# Altium schematic sheet main.SchDoc
size A4; ApprovedBy: Krzysztof Belewicz; CheckedBy: Krzysztof Belewicz; Author: Krzysztof Belewicz; CompanyName: Koło Naukowe Systemów Scalonych; DrawnBy: Krzysztof Belewicz; Organization: KNSS; Address1: Koło Naukowe; Address2: Systemów Scalonych; Address3: 00-665 Warszawa; Address4: Nowowiejska 15/19; DocumentNumber: 1; Revision: 1.0; SheetNumber: 1; SheetTotal: 4
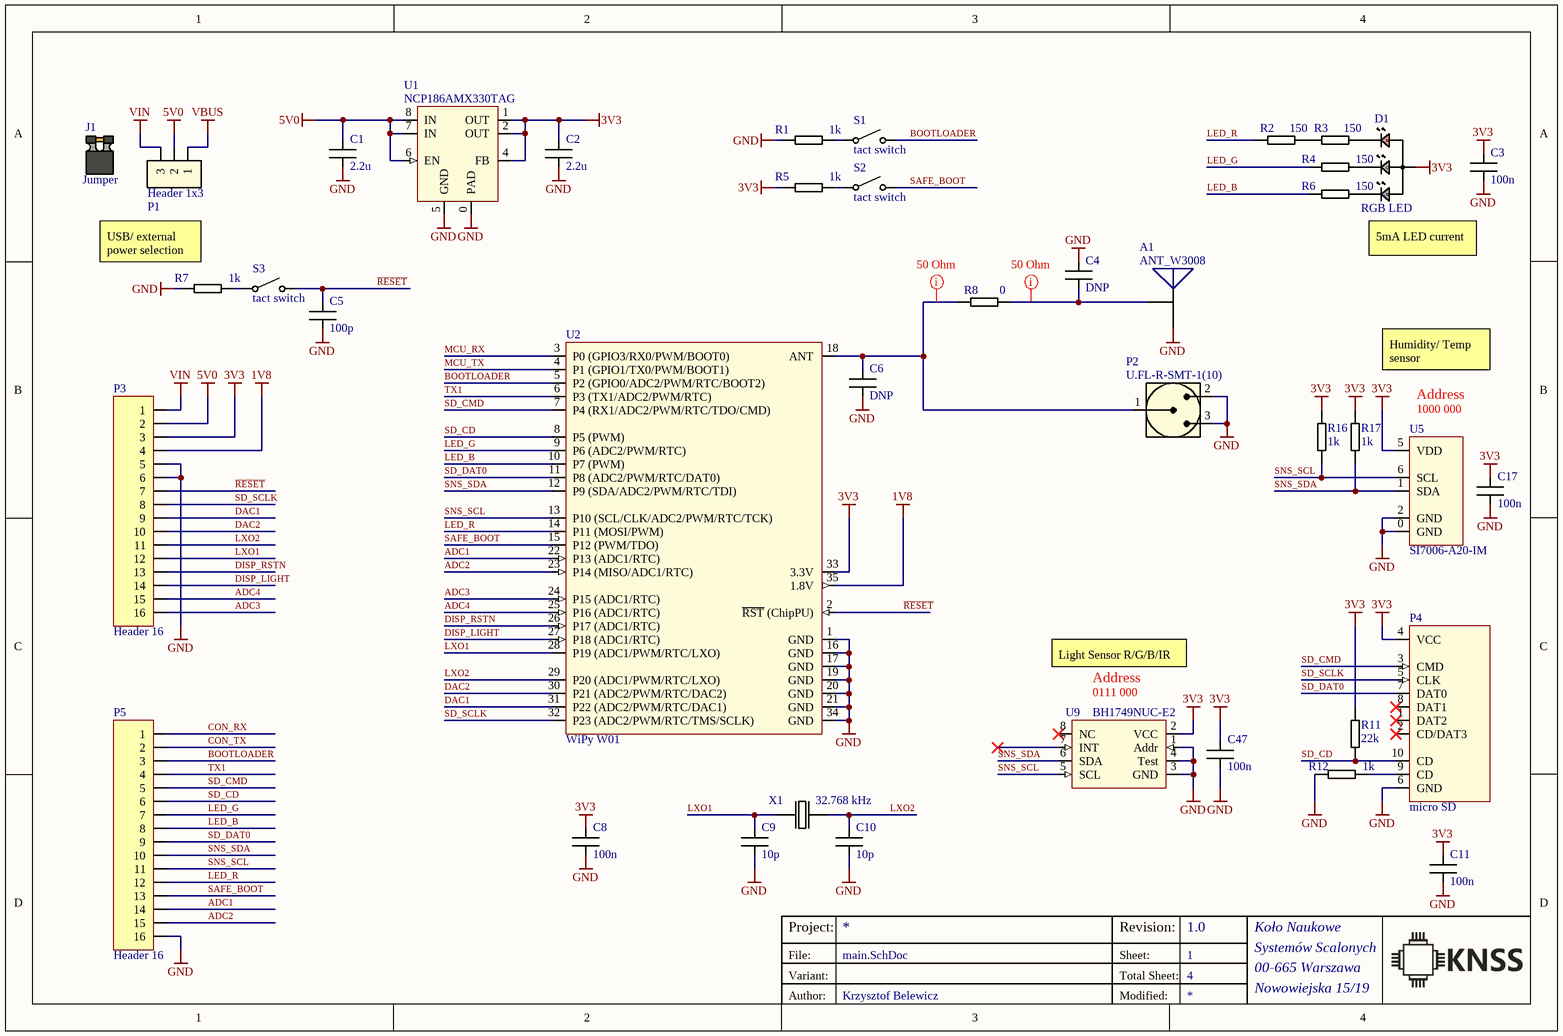
[diagram p0: main.SchDoc]

## Parts
A1  ANT_W3008  [W3008]
C1  value 2.2u  [CAPC1005N]  (hidden comment: Capacitor)
C2  value 2.2u  [CAPC1005N]  (hidden comment: Capacitor)
C3  100n  [CAPC1005N]
C4  value DNP  [CAPC1005N]  (hidden comment: Capacitor)
C5  100p  [CAPC1005N]
C6  value DNP  [CAPC1005N]  (hidden comment: Capacitor)
C8  100n  [CAPC1005N]
C9  10p  [CAPC1005N]
C10  10p  [CAPC1005N]
C11  100n  [CAPC1005N]
C17  100n  [CAPC1005N]
C47  100n  [CAPC1005N]
D1  RGB LED  [PLCC-4]
J1  Jumper  [JUMPER-B]
P1  Header 1x3  [Header 1x3, Male, 2.54mm, Straight, THT]
P2  U.FL-R-SMT-1(10)  [U.FL-R-SMT-1(10)]
P3  Header 16  [HDR1X16]
P4  micro SD  [1140084168]
P5  Header 16  [HDR1X16]
R1  value 1k  [RESC1005N]  (hidden comment: Resistor)
R2  value 150  [RESC1005N]  (hidden comment: Resistor)
R3  value 150  [RESC1005N]  (hidden comment: Resistor)
R4  value 150  [RESC1005N]  (hidden comment: Resistor)
R5  value 1k  [RESC1005N]  (hidden comment: Resistor)
R6  value 150  [RESC1005N]  (hidden comment: Resistor)
R7  value 1k  [RESC1005N]  (hidden comment: Resistor)
R8  value 0  [RESC1005N]  (hidden comment: Resistor)
R11  value 22k  [RESC1005N]  (hidden comment: Resistor)
R12  value 1k  [RESC1005N]  (hidden comment: Resistor)
R16  value 1k  [RESC1005N]  (hidden comment: Resistor)
R17  value 1k  [RESC1005N]  (hidden comment: Resistor)
S1  tact switch  [1301.9319]
S2  tact switch  [1301.9319]
S3  tact switch  [1301.9319]
U1  NCP186AMX330TAG  [XDFN8]
U2  WiPy W01  [WiPy_W01]
U5  SI7006-A20-IM  [DFN6]
U9  BH1749NUC-E2  [WSON-8_Clear]
X1  32.768 kHz  [MC-306]

## Nets
1V8: P3.4 U2.35(1.8V)
3V3: C2.2 C3.2 C8.2 C11.2 C17.2 C47.2 D1.4(A) P3.3 P4.4(VCC) R5.2 R11.2 R16.1 R17.1 U1.1(OUT) U1.2(OUT) U1.4(FB) U2.33(3.3V) U5.5(VDD) U9.2(VCC)
5V0: C1.2 P1.2 P3.2 U1.6(EN) U1.7(IN) U1.8(IN)
GND: A1.2(GND) C1.1 C2.1 C3.1 C4.2 C5.1 C6.1 C8.1 C9.1 C10.1 C11.1 C17.1 C47.1 P2.2 P2.3 P3.5 P3.6 P4.6(GND) P5.16 R1.2 R7.2 R12.2 U1.0(PAD) U1.5(GND) U2.1(GND) U2.16(GND) U2.17(GND) U2.19(GND) U2.20(GND) U2.21(GND) U2.34(GND) U5.0(GND) U5.2(GND) U9.1(Addr) U9.3(GND) U9.4(Test)
VBUS: P1.1
VIN: P1.3 P3.1
ADC1: P5.14 U2.22(P13_(ADC1/RTC))
ADC2: P5.15 U2.23(P14_(MISO/ADC1/RTC))
ADC3: P3.16 U2.24(P15_(ADC1/RTC))
ADC4: P3.15 U2.25(P16_(ADC1/RTC))
BOOTLOADER: P5.3 S1.2 U2.5(P2_(GPIO0/ADC2/PWM/RTC/BOOT2))
CON_RX: P5.1
CON_TX: P5.2
DAC1: P3.9 U2.31(P22_(ADC2/PWM/RTC/DAC1))
DAC2: P3.10 U2.30(P21_(ADC2/PWM/RTC/DAC2))
DISP_LIGHT: P3.14 U2.27(P18_(ADC1/RTC))
DISP_RSTN: P3.13 U2.26(P17_(ADC1/RTC))
LED_B: P5.8 R6.2 U2.10(P7_(PWM))
LED_G: P5.7 R4.2 U2.9(P6_(ADC2/PWM/RTC))
LED_R: P5.12 R2.2 U2.14(P11_(MOSI/PWM))
LXO1: C9.2 P3.12 U2.28(P19_(ADC1/PWM/RTC/LXO)) X1.4
LXO2: C10.2 P3.11 U2.29(P20_(ADC1/PWM/RTC/LXO)) X1.1
MCU_RX: U2.3(P0_(GPIO3/RX0/PWM/BOOT0))
MCU_TX: U2.4(P1_(GPIO1/TX0/PWM/BOOT1))
~{RESET}: C5.2 P3.7 S3.2 U2.2(~{RST}_(ChipPU))
SAFE_BOOT: P5.13 S2.2 U2.15(P12_(PWM/TDO))
SD_CD: P4.10(CD) P5.6 R11.1 U2.8(P5_(PWM))
SD_CMD: P4.3(CMD) P5.5 U2.7(P4_(RX1/ADC2/PWM/RTC/TDO/CMD))
SD_DAT0: P4.7(DAT0) P5.9 U2.11(P8_(ADC2/PWM/RTC/DAT0))
SD_SCLK: P3.8 P4.5(CLK) U2.32(P23_(ADC2/PWM/RTC/TMS/SCLK))
SNS_SCL: P5.11 R16.2 U2.13(P10_(SCL/CLK/ADC2/PWM/RTC/TCK)) U5.6(SCL) U9.5(SCL)
SNS_SDA: P5.10 R17.2 U2.12(P9_(SDA/ADC2/PWM/RTC/TDI)) U5.1(SDA) U9.6(SDA)
TX1: P5.4 U2.6(P3_(TX1/ADC2/PWM/RTC))
NetA1_1: A1.1(SIG) C4.1 R8.1
NetC6_2: C6.2 P2.1 R8.2 U2.18(ANT)
NetD1_1: D1.1(CR) R3.1
NetD1_2: D1.2(CG) R4.1
NetD1_3: D1.3(CB) R6.1
NetP4_9: P4.9(CD) R12.1
NetR1_1: R1.1 S1.1
NetR2_1: R2.1 R3.2
NetR5_1: R5.1 S2.1
NetR7_1: R7.1 S3.1

Not connected (* = marked no-connect by the designer): P4 1(DAT2)* 2(CD/DAT3)* 8(DAT1)*; U9 7(INT)* 8(NC)*

## Layout directives
rule Undefined: NetA1_1, NetC6_2

## Notes on the sheet
- 5mA LED current
- (near R7) USB/ external power selection
- Humidity/ Temp
  sensor
  Addr:
- (near U5) 1000 000
- Address
- Light Sensor R/G/B/IR
- (near U9) 0111 000
- (near U9) Address
- Project:
- Variant:
- File:
- Sheet:
- Revision:
- Total Sheet:
- Author:
- Modified:
- (in symbol ASMB-MTB1-0A3A2) R; G; B

## Library data of the parts
A1 = ANT_W3008: Bluetooth / WLAN / WiFi  Ceramic Chip Antenna W x L x H (3.2 x 1.6 x 1.1 mm); Manufacturer 1: PulseLarsen; Supplier Part Number 1: 673-W3008; Manufacturer Part Number 1: W3008; Manufacturer Part Number 2: W3008; Manufacturer 2: PulseLarsen; Supplier 1: Mouser; Supplier 2: Farnell; Supplier Part Number 2: 2897223
C1 C2 = Capacitor: 0402 SMD Capacitor; Manufacturer 1: MURATA; Manufacturer Part Number 1: GRM155R60J225ME95D; Tolerance: 10%; MaxVoltage: 6.3V; Supplier 1: Farnell; Supplier Part Number 1: 2362091; Manufacturer Part Number 2: GRT155C80J225KE01D; Manufacturer 2: MURATA; Supplier Part Number 2: 2672104; Supplier 2: Farnell
C3 C8 C11 C17 C47 = Capacitor: 0402 SMD Capacitor; Manufacturer Part Number 1: CL05B104KO5NNNC; Manufacturer 1: Samsung; Tolerance: 10%; MaxVoltage: 16V; Supplier 1: TME; Supplier 2: Farnell; Value: 100n; Supplier Part Number 1: CL05B104KO5NNNC; Manufacturer 2: Multicomp; Manufacturer Part Number 2: MC0402B104K100CT; Supplier Part Number 2: 2627343
C4 C6 = Capacitor: 0402 SMD Capacitor; Tolerance: *; MaxVoltage: *; Supplier 1: *; Supplier Part Number 1: *; Manufacturer 1: *; Manufacturer Part Number 1: *
C5 = Capacitor: 0402 SMD Capacitor; Manufacturer Part Number 1: MC0402B101K250CT; Manufacturer 1: Multicomp; Tolerance: 10%; MaxVoltage: 25V; Supplier 1: Farnell; Supplier 2: TME; Value: 100p; Supplier Part Number 1: 1758898; Manufacturer 2: AVX; Manufacturer Part Number 2: 04025A101JAT2A; Supplier Part Number 2: 04025A101JAT2A
C9 C10 = Capacitor: 0402 SMD Capacitor; Manufacturer Part Number 1: VJ0402A100JXACW1BC; Manufacturer 1: VISHAY; Tolerance: 5%; MaxVoltage: 50V; Supplier 1: Farnell; Supplier 2: TME; Value: 10p; Supplier Part Number 1: 2896329; Manufacturer 2: VISHAY; Manufacturer Part Number 2: VJ0402A100FXACW1BC; Supplier Part Number 2: VJ0402A100FXACW1BC
D1 = ASMB-MTB1-0A3A2: LED; SMD; 3528,PLCC4; RGB; 3,5x2,8x1,9mm; 115°; 20mA; Common anode; Manufacturer 1: BROADCOM; Supplier 2: TME; Supplier Part Number 2: ASMB-MTB1-0A3A2; Manufacturer Part Number 1: ASMB-MTB1-0A3A2; Manufacturer 2: BROADCOM; Supplier 1: Farnell; Manufacturer Part Number 2: ASMB-MTB1-0A3A2; Supplier Part Number 1: 2401106
J1 = Header Jumper Black: 1x2, 2.54mm Black header jumper; Manufacturer 1: Multicomp; Manufacturer Part Number 1: MC-2228CG; Supplier 1: Farnell; SMD: No; Supplier Part Number 1: 2834673; Socket: No; Pin count: 0; Supplier 2: TME; Supplier Part Number 2: JUMPER-B; Manufacturer 2: NINIGI; Manufacturer Part Number 2: JUMPER-B
P1 = Header 1x3: Pin header, 1x3, 2.54mm; Manufacturer 1: CONNFLY; Manufacturer Part Number 1: DS1021-1*3SF1-1; Supplier Part Number 1: ZL201-03G; Supplier 1: TME
P2 = U.FL-R-SMT-1(10): Hirose UFL connector; Supplier 1: TME; Supplier Part Number 2: 1688077; Manufacturer 1: Hirose; Manufacturer Part Number 1: U.FL-R-SMT-1(10); Supplier 2: Farnell; Supplier Part Number 1: U.FL-R-SMT-1-10/C
P3 P5 = Header 16: Header, 16-Pin; Manufacturer 1: CONNFLY; Manufacturer Part Number 1: DS1023-1*16S21; Pin count: 17-Jul-2002; Supplier 2: Mouser; Supplier 1: TME; Supplier Part Number 2: 855-M20-7821646; Supplier Part Number 1: ZL262-16SG; Manufacturer 2: Harwin; Manufacturer Part Number 2: M20-7821646
P4 = 1140084168: Memory Card Connectors Micro SD 8 Pin PCB Gold; Manufacturer 1: Amphenol; Supplier 1: Farnell; Manufacturer Part Number 1: 1140084168; Supplier Part Number 1: 2666772; Pin count: 10; Socket: No; SMD: Yes; Supplier 2: Mouser; Manufacturer 2: Amphenol; Manufacturer Part Number 2: 1140084168; Supplier Part Number 2: 523-114-00841-68
R1 R5 R7 R12 R16 R17 = Resistor: 0402 Film SMD Resistor; Manufacturer 1: TE CONNECTIVITY; Manufacturer Part Number 1: CRG0402J1K0; Tolerance: 1%; Power: 0.1W; Supplier 1: Farnell; Supplier Part Number 1: 1174154; Manufacturer Part Number 2: CRCW04021K00FKTDBC; Manufacturer 2: VISHAY; Supplier 2: TME; Supplier Part Number 2: CRCW04021K00FKTDBC
R2-R4 R6 = Resistor: 0402 Film SMD Resistor; Manufacturer 1: TE CONNECTIVITY; Manufacturer Part Number 1: CRGCQ0402F150R; Tolerance: 1%; Power: 0.1W; Supplier 1: Farnell; Supplier Part Number 1: 2861390; Manufacturer Part Number 2: RC0402FR-07150R; Manufacturer 2: YAGEO; Supplier 2: TME; Supplier Part Number 2: RC0402FR-07150R
R8 = Resistor: 0402 Film SMD Resistor; Manufacturer 1: Panasonic; Manufacturer Part Number 1: ERJ-2GE0R00X; Tolerance: 1%; Power: 0.1W; Supplier 1: Farnell; Supplier Part Number 1: ERJ2GE0R00X
R11 = Resistor: 0402 Film SMD Resistor; Manufacturer 1: TE CONNECTIVITY; Manufacturer Part Number 1: CRGCQ0402F22K; Tolerance: 1%; Power: 0.1W; Supplier 1: Farnell; Supplier Part Number 1: 2861416; Manufacturer Part Number 2: CRCW040222K0FKTDBC; Manufacturer 2: VISHAY; Supplier 2: TME; Supplier Part Number 2: CRCW040222K0FKTDBC
S1-S3 = 1301.9319: TACT; SPST-NO; 2 position; 0,05A/12VDC; SMT; Manufacturer 1: Schurter; Supplier 1: Farnell; Manufacturer Part Number 1: 1301.9319; Supplier Part Number 1: 1217771; SMD: Yes; Pin count: 4; Manufacturer 2: Schurter; Manufacturer Part Number 2: 1301.9319; Socket: No; Supplier 2: TME; Supplier Part Number 2: 1301.9319
U1 = NCP186AMX330TAG: 3.3V 1A LDO Voltage Regulator; Manufacturer 1: ON SEMICONDUCTOR; Dropout: 95mV; Manufacturer Part Number 1: NCP186AMX330TAG; Supplier 1: Farnell; Max Current: 1A; Supplier Part Number 1: 2507590; Value: 3.3V; Supplier 2: Mouser; Supplier Part Number 2: 863-NCP186AMX330TAG
U2 = W01: Wireless LAN Module, I2C, I2S, SPI, UART, M2M, Internet of Things; Manufacturer 1: Pycom; Pin count: 35; Socket: No; Manufacturer Part Number 1: W01; SMD: Yes; Supplier Part Number 1: 2834998; Supplier 1: Farnell; Supplier 2: Mouser; Manufacturer 2: Pycom; Manufacturer Part Number 2: W01; Supplier Part Number 2: 365-W01
U5 = SI7006-A20-IM: I2C HUMIDITY AND TEMPERATURE SENSOR; Manufacturer 1: Silicon Labs; Manufacturer Part Number 1: SI7006-A20-IM; Supplier 1: Farnell; Supplier Part Number 1: 2473658; Supplier 2: Mouser; Supplier Part Number 2: 634-SI7006-A20-IM; Manufacturer 2: Silicon Labs; Manufacturer Part Number 2: SI7006-A20-IM
U9 = BH1749NUC-E2: Ambient Colour Sensor, Digital I2C Output, 650nm/540nm/450nm Peak Sense, 2.3V to 3.6V Supply, WSON-8; Manufacturer 1: ROHM; Manufacturer Part Number 1: BH1749NUC-E2; Manufacturer Part Number 2: BH1749NUC-E2; Manufacturer 2: ROHM; Supplier 2: Mouser; Supplier Part Number 2: 755-BH1749NUC-E2; Supplier 1: Farnell; Supplier Part Number 1: 2908648
X1 = MC306 32.768000KHZ 12.5PF: Standard Clock Oscillators 32,768kHz 20ppm -40C +85C; Manufacturer 1: Epson Timing; Manufacturer Part Number 1: MC306 32.768000KHZ 12.5PF; SMD: Yes; Supplier 1: TME; Supplier Part Number 1: 32.768KHZ-MC306; Manufacturer Part Number 2: MC306 32.768000KHZ 12.5PF; Manufacturer 2: Epson Timing; Supplier 2: Farnell; Supplier Part Number 2: 1216208